# Altium schematic sheet FPGA_GND_NC.SchDoc: =ProjectName
size 420 x 297 mm; Author: T.P.; CompanyName: WUT; DrawnBy: T.P.; Organization: WUT ISE; Address1: Warsaw Univeristy of Technology; Address2: Nowowiejska 15/19; DocumentNumber: 13; Revision: 0.9; SheetNumber: 13; SheetTotal: 36; EDA_Number: ARTIQ; Projet: ARTIQ/SINARA; ModifiedBy: -; CreateDate: XX/XX/XXXX; CheckedDate: -; Title2: FPGA_GND_NC.SchDoc; DivGrp: ISE; Designer: G.K. and T.P.; ModifiedDate: -; ProjectName: ADC/DAC MEZZANINE
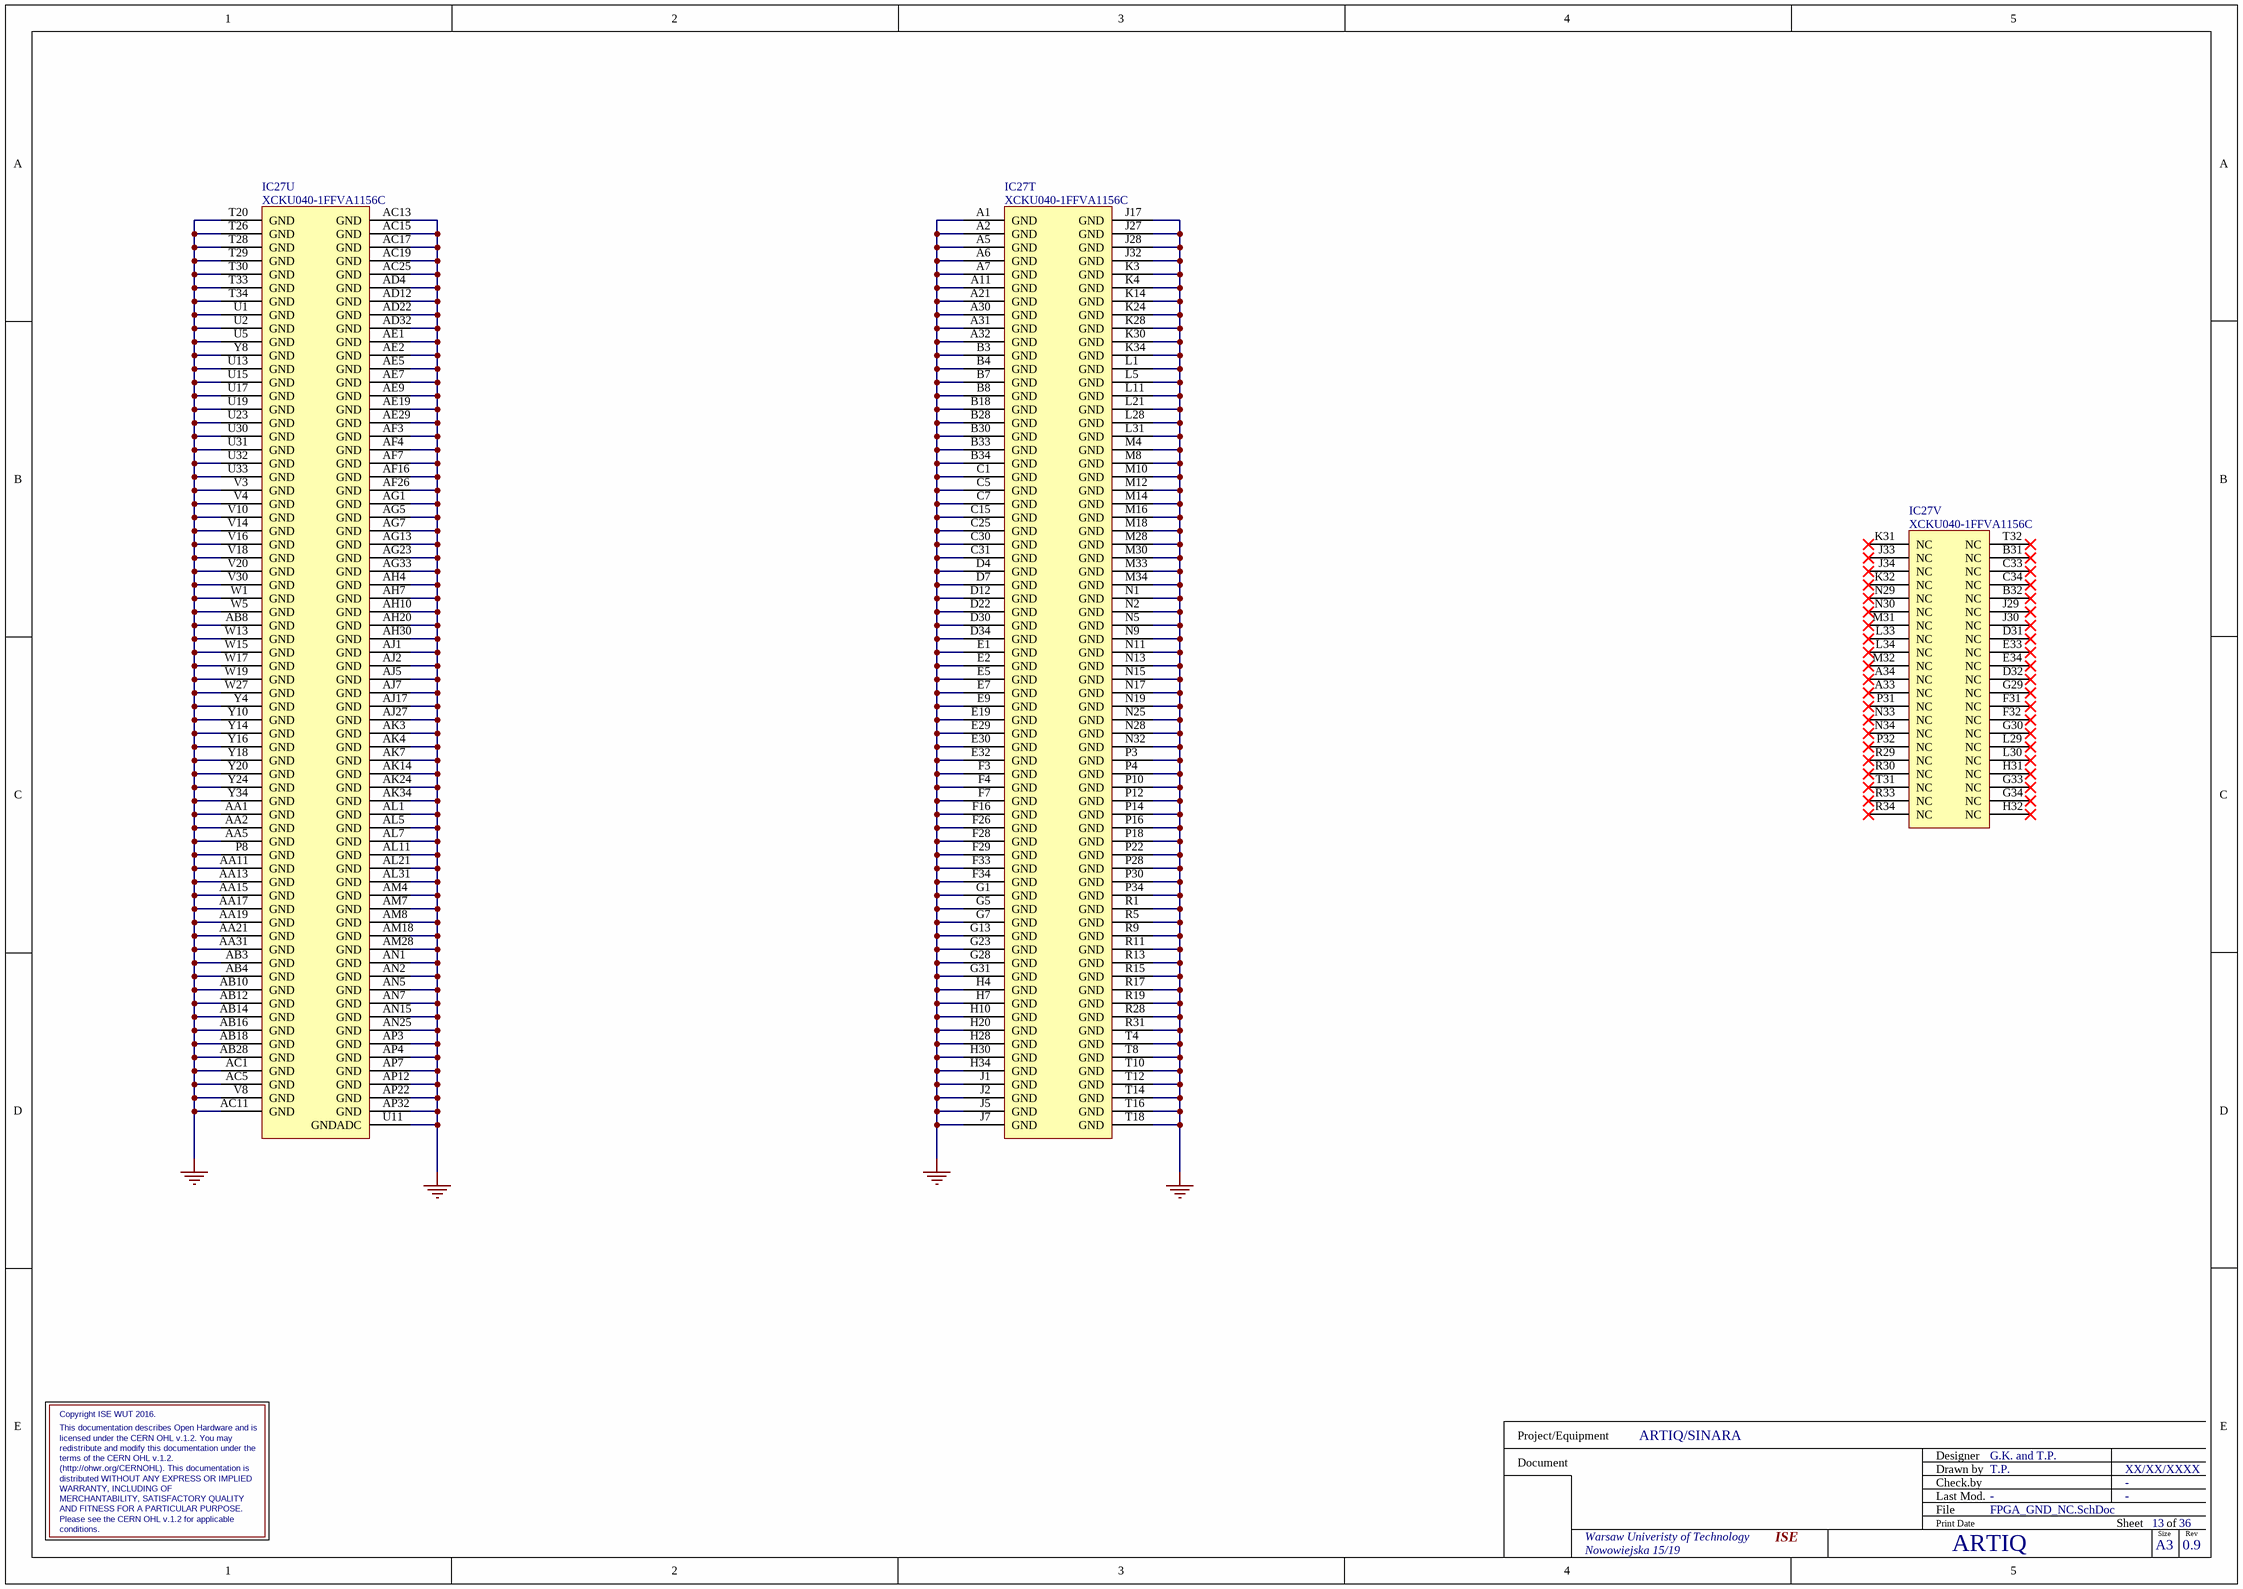
[diagram p0: FPGA_GND_NC.SchDoc]

## Parts
IC27  XCKU040-1FFVA1156C  [BGA1156C100P34X34_3500X3500X350]  (parts T,U,V of 22)

## Nets
GND: IC27.A1(GND) IC27.A2(GND) IC27.A5(GND) IC27.A6(GND) IC27.A7(GND) IC27.A11(GND) IC27.A21(GND) IC27.A30(GND) IC27.A31(GND) IC27.A32(GND) IC27.AA1(GND) IC27.AA2(GND) IC27.AA5(GND) IC27.AA11(GND) IC27.AA13(GND) IC27.AA15(GND) IC27.AA17(GND) IC27.AA19(GND) IC27.AA21(GND) IC27.AA31(GND) IC27.AB3(GND) IC27.AB4(GND) IC27.AB8(GND) IC27.AB10(GND) IC27.AB12(GND) IC27.AB14(GND) IC27.AB16(GND) IC27.AB18(GND) IC27.AB28(GND) IC27.AC1(GND) IC27.AC5(GND) IC27.AC11(GND) IC27.AC13(GND) IC27.AC15(GND) IC27.AC17(GND) IC27.AC19(GND) IC27.AC25(GND) IC27.AD4(GND) IC27.AD12(GND) IC27.AD22(GND) IC27.AD32(GND) IC27.AE1(GND) IC27.AE2(GND) IC27.AE5(GND) IC27.AE7(GND) IC27.AE9(GND) IC27.AE19(GND) IC27.AE29(GND) IC27.AF3(GND) IC27.AF4(GND) IC27.AF7(GND) IC27.AF16(GND) IC27.AF26(GND) IC27.AG1(GND) IC27.AG5(GND) IC27.AG7(GND) IC27.AG13(GND) IC27.AG23(GND) IC27.AG33(GND) IC27.AH4(GND) IC27.AH7(GND) IC27.AH10(GND) IC27.AH20(GND) IC27.AH30(GND) IC27.AJ1(GND) IC27.AJ2(GND) IC27.AJ5(GND) IC27.AJ7(GND) IC27.AJ17(GND) IC27.AJ27(GND) IC27.AK3(GND) IC27.AK4(GND) IC27.AK7(GND) IC27.AK14(GND) IC27.AK24(GND) IC27.AK34(GND) IC27.AL1(GND) IC27.AL5(GND) IC27.AL7(GND) IC27.AL11(GND) IC27.AL21(GND) IC27.AL31(GND) IC27.AM4(GND) IC27.AM7(GND) IC27.AM8(GND) IC27.AM18(GND) IC27.AM28(GND) IC27.AN1(GND) IC27.AN2(GND) IC27.AN5(GND) IC27.AN7(GND) IC27.AN15(GND) IC27.AN25(GND) IC27.AP3(GND) IC27.AP4(GND) IC27.AP7(GND) IC27.AP12(GND) IC27.AP22(GND) IC27.AP32(GND) IC27.B3(GND) IC27.B4(GND) IC27.B7(GND) IC27.B8(GND) IC27.B18(GND) IC27.B28(GND) IC27.B30(GND) IC27.B33(GND) IC27.B34(GND) IC27.C1(GND) IC27.C5(GND) IC27.C7(GND) IC27.C15(GND) IC27.C25(GND) IC27.C30(GND) IC27.C31(GND) IC27.D4(GND) IC27.D7(GND) IC27.D12(GND) IC27.D22(GND) IC27.D30(GND) IC27.D34(GND) IC27.E1(GND) IC27.E2(GND) IC27.E5(GND) IC27.E7(GND) IC27.E9(GND) IC27.E19(GND) IC27.E29(GND) IC27.E30(GND) IC27.E32(GND) IC27.F3(GND) IC27.F4(GND) IC27.F7(GND) IC27.F16(GND) IC27.F26(GND) IC27.F28(GND) IC27.F29(GND) IC27.F33(GND) IC27.F34(GND) IC27.G1(GND) IC27.G5(GND) IC27.G7(GND) IC27.G13(GND) IC27.G23(GND) IC27.G28(GND) IC27.G31(GND) IC27.H4(GND) IC27.H7(GND) IC27.H10(GND) IC27.H20(GND) IC27.H28(GND) IC27.H30(GND) IC27.H34(GND) IC27.J1(GND) IC27.J2(GND) IC27.J5(GND) IC27.J7(GND) IC27.J17(GND) IC27.J27(GND) IC27.J28(GND) IC27.J32(GND) IC27.K3(GND) IC27.K4(GND) IC27.K14(GND) IC27.K24(GND) IC27.K28(GND) IC27.K30(GND) IC27.K34(GND) IC27.L1(GND) IC27.L5(GND) IC27.L11(GND) IC27.L21(GND) IC27.L28(GND) IC27.L31(GND) IC27.M4(GND) IC27.M8(GND) IC27.M10(GND) IC27.M12(GND) IC27.M14(GND) IC27.M16(GND) IC27.M18(GND) IC27.M28(GND) IC27.M30(GND) IC27.M33(GND) IC27.M34(GND) IC27.N1(GND) IC27.N2(GND) IC27.N5(GND) IC27.N9(GND) IC27.N11(GND) IC27.N13(GND) IC27.N15(GND) IC27.N17(GND) IC27.N19(GND) IC27.N25(GND) IC27.N28(GND) IC27.N32(GND) IC27.P3(GND) IC27.P4(GND) IC27.P8(GND) IC27.P10(GND) IC27.P12(GND) IC27.P14(GND) IC27.P16(GND) IC27.P18(GND) IC27.P22(GND) IC27.P28(GND) IC27.P30(GND) IC27.P34(GND) IC27.R1(GND) IC27.R5(GND) IC27.R9(GND) IC27.R11(GND) IC27.R13(GND) IC27.R15(GND) IC27.R17(GND) IC27.R19(GND) IC27.R28(GND) IC27.R31(GND) IC27.T4(GND) IC27.T8(GND) IC27.T10(GND) IC27.T12(GND) IC27.T14(GND) IC27.T16(GND) IC27.T18(GND) IC27.T20(GND) IC27.T26(GND) IC27.T28(GND) IC27.T29(GND) IC27.T30(GND) IC27.T33(GND) IC27.T34(GND) IC27.U1(GND) IC27.U2(GND) IC27.U5(GND) IC27.U11(GNDADC) IC27.U13(GND) IC27.U15(GND) IC27.U17(GND) IC27.U19(GND) IC27.U23(GND) IC27.U30(GND) IC27.U31(GND) IC27.U32(GND) IC27.U33(GND) IC27.V3(GND) IC27.V4(GND) IC27.V8(GND) IC27.V10(GND) IC27.V14(GND) IC27.V16(GND) IC27.V18(GND) IC27.V20(GND) IC27.V30(GND) IC27.W1(GND) IC27.W5(GND) IC27.W13(GND) IC27.W15(GND) IC27.W17(GND) IC27.W19(GND) IC27.W27(GND) IC27.Y4(GND) IC27.Y8(GND) IC27.Y10(GND) IC27.Y14(GND) IC27.Y16(GND) IC27.Y18(GND) IC27.Y20(GND) IC27.Y24(GND) IC27.Y34(GND)

Not connected (* = marked no-connect by the designer): IC27 A33(NC)* A34(NC)* B31(NC)* B32(NC)* C33(NC)* C34(NC)* D31(NC)* D32(NC)* E33(NC)* E34(NC)* F31(NC)* F32(NC)* G29(NC)* G30(NC)* G33(NC)* G34(NC)* H31(NC)* H32(NC)* J29(NC)* J30(NC)* J33(NC)* J34(NC)* K31(NC)* K32(NC)* L29(NC)* L30(NC)* L33(NC)* L34(NC)* M31(NC)* M32(NC)* N29(NC)* N30(NC)* N33(NC)* N34(NC)* P31(NC)* P32(NC)* R29(NC)* R30(NC)* R33(NC)* R34(NC)* T31(NC)* T32(NC)*

## Notes on the sheet
- Copyright ISE WUT 2016.
- licensed under the CERN OHL v.1.2. You may
- (http://ohwr.org/CERNOHL). This documentation is
- distributed WITHOUT ANY EXPRESS OR IMPLIED
- terms of the CERN OHL v.1.2.
- redistribute and modify this documentation under the
- This documentation describes Open Hardware and is
- WARRANTY, INCLUDING OF
- MERCHANTABILITY, SATISFACTORY QUALITY
- Please see the CERN OHL v.1.2 for applicable
- conditions.
- AND FITNESS FOR A PARTICULAR PURPOSE.
- Project/Equipment
- Document
- Designer
- Drawn by
- Check.by
- File
- Last Mod.
- Print Date
- Sheet
- Size
- A3
- of
- Rev

## Library data of the parts
IC27 = XCKU040-1FFVA1156C: Kintex UltraScale FPGA, 520 I/O, 530K Cells, 1156-Ball BGA, Speed Grade 1, Commercial Grade; Manufacturer: XILINX; Part Description: Kintex UltraScale, 40 DLL I/O, 416 HP I/O, 104 HR I/O, 1156-Pin BGA, Speed Grade 1, Commercial Grade; PressFit: No; Bonding: No; Manufacturer Part Number: XCKU040-1FFVA1156C; PackageDescription: BGA, 1.00mm Pitch, Square; 1156 Pin, 34 Columns X 34 Rows, Body 35.00mm X 35.00mm X 3.50mm H, IPC Medium Density; Part Number: XCKU040-1FFVA1156C; Component Kind: Standard; Component Type: Standard; Device: XCKU040-1FFVA1156C; Pin Count: 1156; Case: BGA1156; Mounted: Yes; Socket: No; SMD: Yes; Sense: No; ComponentHeight: 3.5mm; HelpURL: \\cern.ch\dfs\Applications\Altium\Datasheets\XCKU040-1FFVA1156C.pdf; ComponentLink1URL: \\cern.ch\dfs\Applications\Altium\Datasheets\XCKU040-1FFVA1156C_Package-Pinout.pdf; ComponentLink1Description: Package/Pinout; Author: CERN DEM CA; CreateDate: 16.08.2016; LatestRevisionDate: 16.08.2016